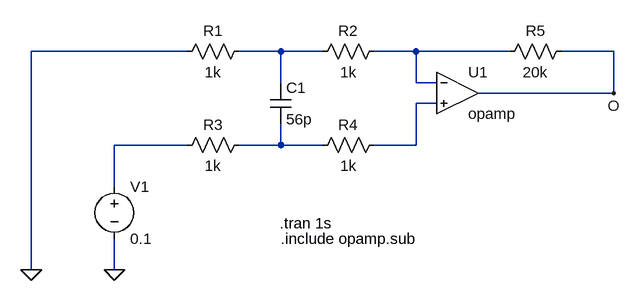
[diagram p0: schematic op.asc]
op.asc, the LTspice schematic file:
Version 4
SHEET 1 880 680
WIRE 0 96 -240 96
WIRE 144 96 80 96
WIRE 208 96 144 96
WIRE 352 96 288 96
WIRE 496 96 352 96
WIRE 656 96 576 96
WIRE 144 144 144 96
WIRE 352 144 352 96
WIRE 384 144 352 144
WIRE 656 160 656 96
WIRE 656 160 448 160
WIRE 384 176 352 176
WIRE 0 240 -112 240
WIRE 144 240 144 208
WIRE 144 240 80 240
WIRE 208 240 144 240
WIRE 352 240 352 176
WIRE 352 240 288 240
WIRE -112 304 -112 240
WIRE -240 432 -240 96
WIRE -112 432 -112 384
FLAG 656 160 O
FLAG -240 432 0
FLAG -112 432 0
SYMBOL voltage -112 288 R0
WINDOW 123 0 0 Left 2
WINDOW 39 0 0 Left 2
SYMATTR InstName V1
SYMATTR Value 0.1
SYMBOL res 96 80 R90
WINDOW 0 0 56 VBottom 2
WINDOW 3 32 56 VTop 2
SYMATTR InstName R1
SYMATTR Value 1k
SYMBOL res 304 80 R90
WINDOW 0 0 56 VBottom 2
WINDOW 3 32 56 VTop 2
SYMATTR InstName R2
SYMATTR Value 1k
SYMBOL res 96 224 R90
WINDOW 0 0 56 VBottom 2
WINDOW 3 32 56 VTop 2
SYMATTR InstName R3
SYMATTR Value 1k
SYMBOL res 304 224 R90
WINDOW 0 0 56 VBottom 2
WINDOW 3 32 56 VTop 2
SYMATTR InstName R4
SYMATTR Value 1k
SYMBOL cap 128 144 R0
SYMATTR InstName C1
SYMATTR Value 56p
SYMBOL res 592 80 R90
WINDOW 0 0 56 VBottom 2
WINDOW 3 32 56 VTop 2
SYMATTR InstName R5
SYMATTR Value 20k
SYMBOL Opamps\\opamp 416 96 R0
SYMATTR InstName U1
TEXT 142 360 Left 2 !.tran 1s
TEXT 144 384 Left 2 !.include opamp.sub

The netlist it stands for:
* op.asc
V1 N004 0 0.1
R1 N001 0 1k
R2 N002 N001 1k
R3 N005 N004 1k
R4 N003 N005 1k
C1 N001 N005 56p
R5 O N002 20k
XU1 N002 N003 O opamp Aol=100K GBW=10Meg  ; pins invin noninvin out
.tran 1s
.include opamp.sub
.backanno
.end